# Altium schematic sheet microcontroller.SchDoc
size A4; Date: 08.06.2024; ApprovedBy: Jan Macheta; Author: Mikołaj Pichita; SheetNumber: 5; SheetTotal: 8
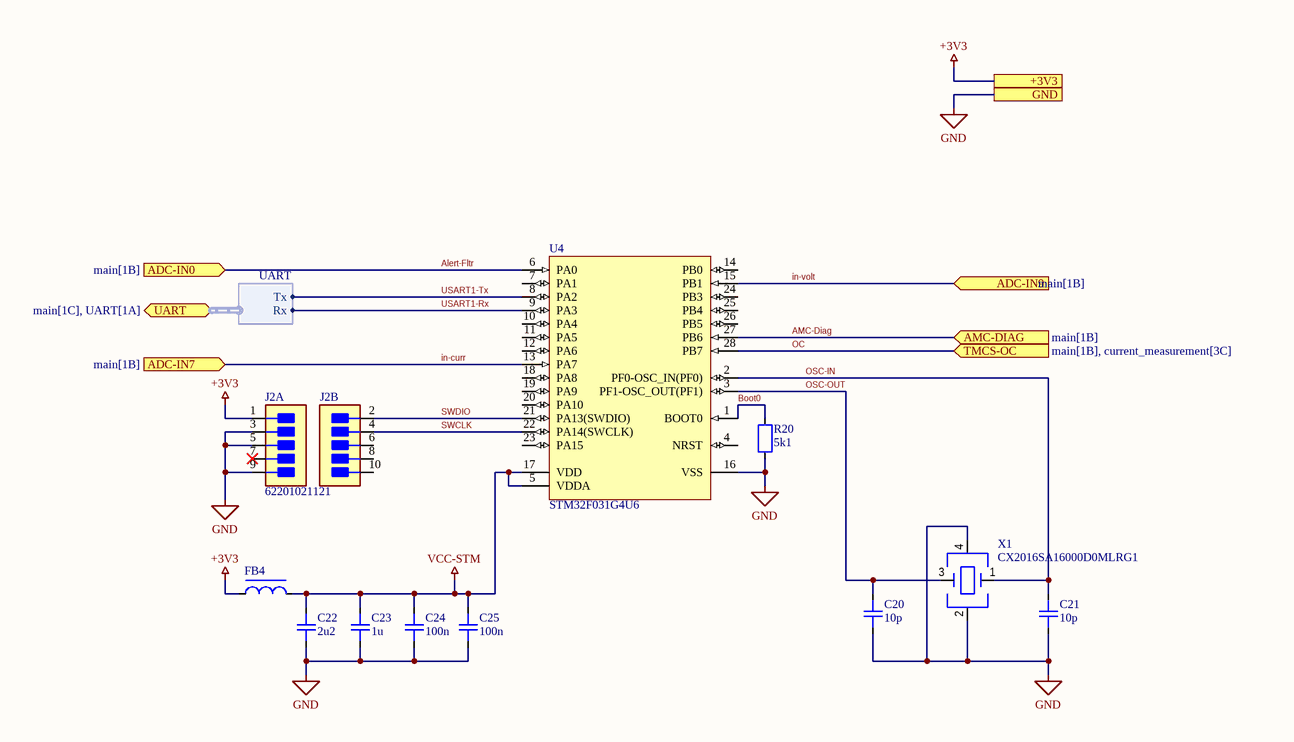
[diagram p0: microcontroller.SchDoc]

## Parts
C20  10p  [CAP0603]
C21  10p  [CAP0603]
C22  2u2  [CAP0603]
C23  1u  [CAP0603]
C24  100n  [CAP0204]
C25  100n  [CAP0204]
FB4  *  [FB0402]  (value not drawn)
J2  62201021121  [62201021121]  (parts A,B of 2)
R20  5k1  [RES0603]
U4  STM32F031G4U6  [STM-UFQFPN28_V]
X1  CX2016SA16000D0MLRG1  [CX2016]

## Ports
+3V3 (see main[1C], analog[4A], current_measurement[1C], power[2A], UART[1A], voltage_measurement[4D]), ADC-IN0 (in, see main[1B]), ADC-IN7 (in, see main[1B]), ADC-IN9 (in, see main[1B]), AMC-DIAG (in, see main[1B]), GND (see main[1C], analog[4A], current_measurement[1C], power[2B], UART[1A], voltage_measurement[4D]), TMCS-OC (in, see main[1B], current_measurement[3C]), UART (bidir, harness UART, see main[1C], UART[1A])

## Harnesses
UART: Tx, Rx

## Nets
+3V3: FB4.1 J2.1 ; port +3V3
GND: C20.2 C21.2 C22.2 C23.2 C24.2 C25.2 J2.3 J2.5 J2.9 R20.2 U4.16(VSS) X1.2 X1.4 ; port GND
VCC-STM: C22.1 C23.1 C24.1 C25.1 FB4.2 U4.5(VDDA) U4.17(VDD)
Alert-Fltr: U4.6(PA0) ; port ADC-IN0
AMC-Diag: U4.27(PB6) ; port AMC-DIAG
Boot0: R20.1 U4.1(BOOT0)
in-curr: U4.13(PA7) ; port ADC-IN7
in-volt: U4.15(PB1) ; port ADC-IN9
OC: U4.28(PB7) ; port TMCS-OC
OSC-IN: C21.1 U4.2(PF0-OSC_IN(PF0)) X1.1
OSC-OUT: C20.1 U4.3(PF1-OSC_OUT(PF1)) X1.3
SWCLK: J2.4 U4.22(PA14(SWCLK))
SWDIO: J2.2 U4.21(PA13(SWDIO))
USART1-Rx: U4.9(PA3) ; port UART.Rx
USART1-Tx: U4.8(PA2) ; port UART.Tx

Not connected (* = marked no-connect by the designer): J2 6 7* 8 10; U4 4(NRST) 7(PA1) 10(PA4) 11(PA5) 12(PA6) 14(PB0) 18(PA8) 19(PA9) 20(PA10) 23(PA15) 24(PB3) 25(PB4) 26(PB5)

## Notes on the sheet
- Project name:
- Document name:
- Company name:
- Author:
- Reviewer:
- AGH University of Krakow
- Date:

## Library data of the parts
C20-C25 = Capacitor: Value: *; HelpURL: *; MPN: *; Supplier: *; SupplierPartNumber: *
FB4 = Ferrite Bead: Value: *; HelpURL: *; MPN: *; Supplier: *; SupplierPartNumber: *
J2 = 62201021121: CONN HEADER VERT 10POS 1.27MM; Contact Post Length: 0.12inch; Selectively Loaded: No (Without); High Speed Serial Data Connector: No; Contact Current Rating: 3A; Approvals: CSA; Voltage Rating: 750V; Number of Positions: 14; PCB Mount Retention: Without; High Temperature Housing: Yes; Connector Type: Plug; Pitch: 2.54mm; Insulation Resistance: 5GR; PCB Thickness: 0.062inch; PCB Mounting Orientation: Vertical; Board Standoff: Yes (With); Housing Material: Thermoplastic; Series: AMPMODU MOD II; Length: 17.37mm; Contact Material: Bronze; Stabilizers: No (Without); Gasket: No (Without); Depth: 4.88mm; Contact Gender: Male; Current Rating: 3A; ELV: Compliant; Packaging: Carton; Contact Plating: Gold; Color: Black; Package Quantity: 200; Contact Protection: No (Without); Contact Type: Male Pin; Mount: Through Hole; Strain Relief: No (Without); Flammability Rating: UL94 V-0; Max Operating Temperature: 105°C; Radiation Hardening: No; Row Spacing: 2.54mm; Mating Connector Lock: No (Without); RoHS Compliant: Yes; Keyed: No; Mating Alignment: No (Without); Contact Mating Length: 0.23inch; Number of Rows: 2; Number of Contacts: 14; Housing Color: Black; Lead Free: Lead Free; Orientation: Straight; Termination: Through Hole; Min Operating Temperature: -65°C; Contact Shape: Square
R20 = Resistor: Value: *; HelpURL: *; MPN: *; Supplier: *; SupplierPartNumber: *
U4 = STM32F031G4U6: ARM Cortex-M0 32-bit MCU, 16 KB Flash, 4 KB Internal RAM, 23 I/Os, 28-Pin UFQFPN, -40 to 85 degC, Tray; FLASH Size (Prog) (kB): 16; Supply Voltage(Vcc) min (V): 2; I/Os (High Current): 23; Internal RAM Size (kB): 4; Operating Frequency(F) (Processor speed) (MHz): 48; Package Description: 28-Pin Ultra Thin Fine Pitch Quad Flat No-Lead, 4 x 4 x 0.6 mm Body, 0.5 mm Pitch; ComponentLink1URL: http://www.st.com/; Package Reference: UFQFPN28; ComponentLink1Description: Manufacturer URL; ComponentLink2Description: Datasheet; Packing: Tray; ComponentLink2URL: http://www.st.com/st-web-ui/static/active/en/resource/technical/document/datasheet/DM00104043.pdf; Core: ARM Cortex-M0; DatasheetVersion: Rev. 3; Mounting Technology: Surface Mount
X1 = CX2016SA16000D0MLRG1: Crystals 2.0mm x 1.6mm Crystal 16MHz 8pF +/-40ppm; Value: *; HelpURL: *; MPN: *; Supplier: *; SupplierPartNumber: *